# Altium schematic sheet STM32G4_microcontroller.SchDoc: STM32G4 microcontroller
size A4; Date: Not used; ApprovedBy: Not used; CheckedBy: Not used; Author: Not used; CompanyName: STMicroelectronics; DrawnBy: Not used; Engineer: Not used; Organization: Not used; Address1: Not used; Address2: Not used; Address3: Not used; Address4: Not used; DocumentNumber: Not used; Revision: Not used; SheetNumber: 3; SheetTotal: 7; CurrentTime: Not used; CurrentDate: Not used; Time: Not used; DocumentFullPathAndName: Not used; DocumentName: Not used; ModifiedDate: Not used; ImagePath: Not used; ProjectName: Not used; Application_BuildNumber: Not used
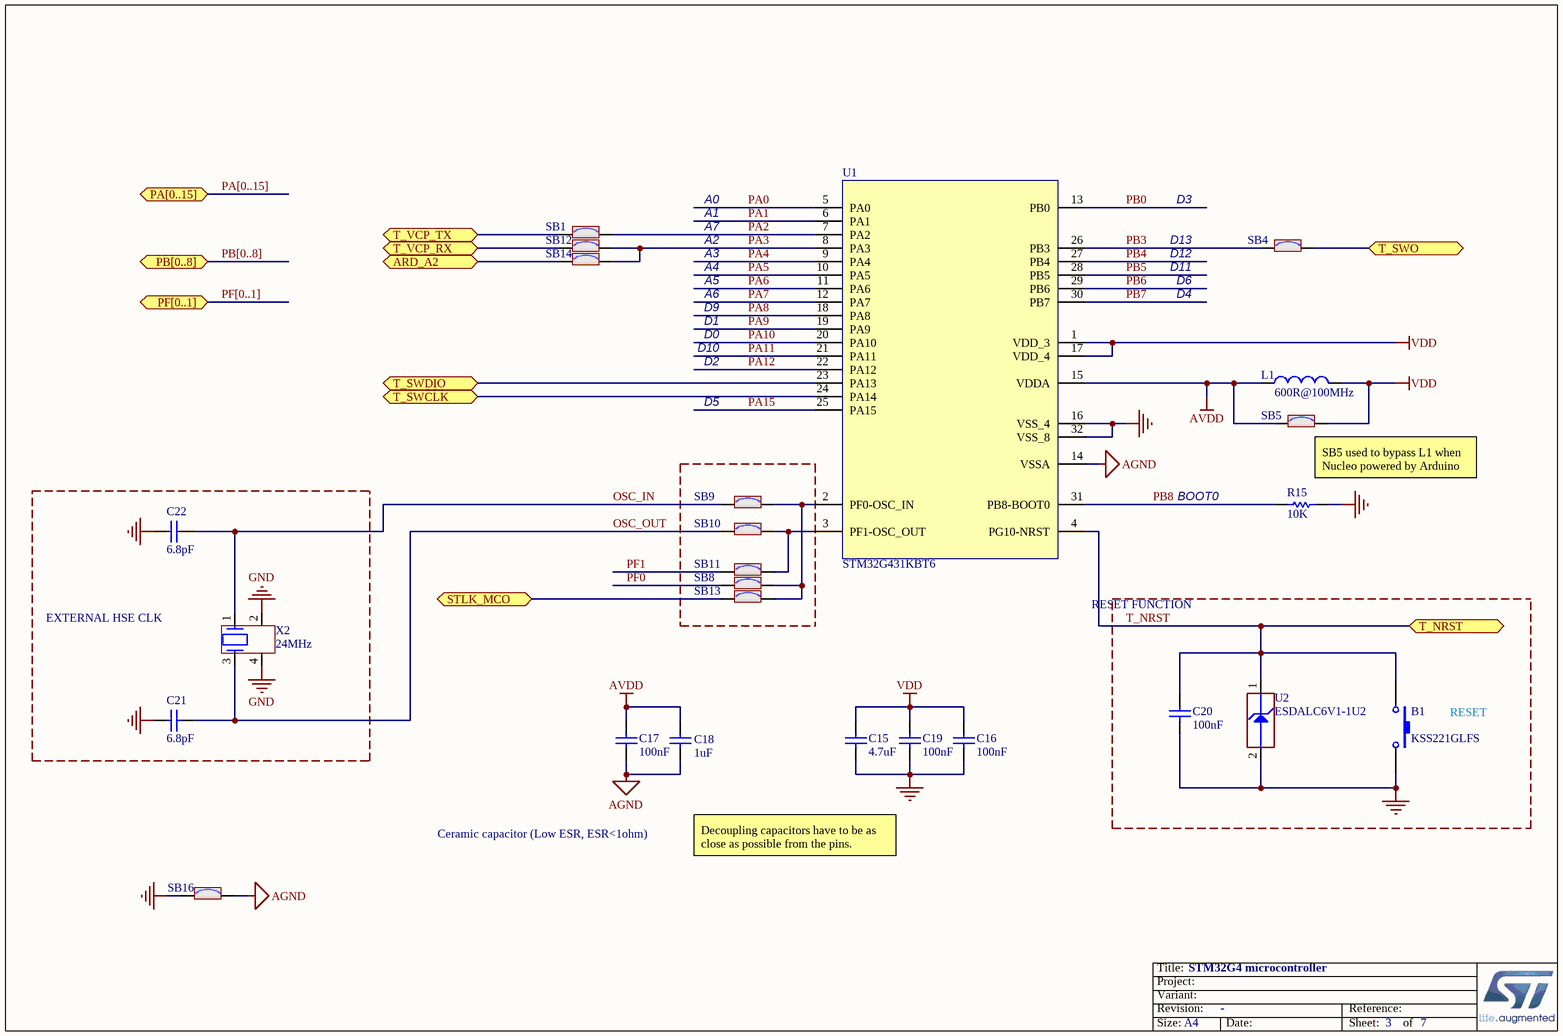
[diagram p0: STM32G4_microcontroller.SchDoc]

## Parts
B1  value KSS221GLFS  [SWI_C&K_ITT_KSS221G]
C15  value 4.7uF  [C0603]
C16  value 100nF  [C0402]
C17  value 100nF  [C0402]
C18  value 1uF  [C0603]
C19  value 100nF  [C0402]
C20  value 100nF  [C0402]
C21  value 6.8pF  [C0402]
C22  value 6.8pF  [C0402]
L1  value 600R@100MHz  [L0603]
R15  value 10K  [R0603]
SB1  (no value)  [SOLDER-BRIDGE_R0603-0R]
SB4  (no value)  [SOLDER-BRIDGE_R0603-0R]
SB5  (no value)  [SOLDER-BRIDGE_R0603-0R]
SB8  (no value)  [SOLDER-BRIDGE_R0603-0R]
SB9  (no value)  [SOLDER-BRIDGE_R0603-0R]
SB10  (no value)  [SOLDER-BRIDGE_R0603-0R]
SB11  (no value)  [SOLDER-BRIDGE_R0603-0R]
SB12  (no value)  [SOLDER-BRIDGE_R0603-0R]
SB13  (no value)  [SOLDER-BRIDGE_R0603-0R]
SB14  (no value)  [SOLDER-BRIDGE_R0603-0R]
SB16  (no value)  [SOLDER-BRIDGE_R0603-0R]
U1  value STM32G431KBT6  [ICC_LQFP32_7X7_P080__UFQFPN32-EPAD_5X5_P050__DI]
U2  value ESDALC6V1-1U2  [ESD_ST0201]
X2  value 24MHz  [CRY_NX2016SA_4P]

## Blocks framed on the sheet
EXTERNAL HSE CLK: C21 C22 X2

## Ports
ARD_A2, PA[0..15] (bidir), PB[0..8] (bidir), PF[0..1] (bidir), STLK_MCO, T_NRST, T_SWCLK, T_SWDIO, T_SWO, T_VCP_RX, T_VCP_TX

## Nets
AGND: C17.1 C18.1 SB16.2 U1.14(VSSA)
AVDD: C17.2 C18.2 L1.1 SB5.1 U1.15(VDDA)
GND: B1.2 C15.1 C16.1 C19.1 C20.1 C21.1 C22.1 R15.1 SB16.1 U1.16(VSS_4) U1.32(VSS_8) U2.2(GND) X2.2 X2.4
VDD: C15.2 C16.2 C19.2 L1.2 SB5.2 U1.1(VDD_3) U1.17(VDD_4)
ARD_A2: SB14.1 ; port ARD_A2
OSC_IN: C22.2 SB9.1 X2.1
OSC_OUT: C21.2 SB10.1 X2.3
PA0: U1.5(PA0)
PA1: U1.6(PA1)
PA2: SB1.2 U1.7(PA2)
PA3: SB12.2 SB14.2 U1.8(PA3)
PA4: U1.9(PA4)
PA5: U1.10(PA5)
PA6: U1.11(PA6)
PA7: U1.12(PA7)
PA8: U1.18(PA8)
PA9: U1.19(PA9)
PA10: U1.20(PA10)
PA11: U1.21(PA11)
PA12: U1.22(PA12)
PA15: U1.25(PA15)
PB0: U1.13(PB0)
PB3: SB4.1 U1.26(PB3)
PB4: U1.27(PB4)
PB5: U1.28(PB5)
PB6: U1.29(PB6)
PB7: U1.30(PB7)
PB8: R15.2 U1.31(PB8-BOOT0)
PF0: SB8.1
PF1: SB11.1
STLK_MCO: SB13.1 ; port STLK_MCO
T_NRST: B1.1 C20.2 U1.4(PG10-NRST) U2.1(IO1) ; port T_NRST
T_SWCLK: U1.24(PA14) ; port T_SWCLK
T_SWDIO: U1.23(PA13) ; port T_SWDIO
T_SWO: SB4.2 ; port T_SWO
T_VCP_RX: SB12.1 ; port T_VCP_RX
T_VCP_TX: SB1.1 ; port T_VCP_TX
NetSB8_2: SB8.2 SB9.2 SB13.2 U1.2(PF0-OSC_IN)
NetSB10_2: SB10.2 SB11.2 U1.3(PF1-OSC_OUT)

## Buses and harness runs
bus PA[0..15] = port PA[0..15]
bus PB[0..8] = port PB[0..8]
bus PF[0..1] = port PF[0..1]

## Notes on the sheet
- A0
- A1
- A2
- A7
- D13
- D3
- D9
- A3
- A4
- A5
- A6
- D12
- D11
- D4
- D6
- D1
- D0
- D10
- D2
- D5
- (near R15) BOOT0
- (near SB5) SB5 used to bypass L1 when Nucleo powered by Arduino AVDD.
- RESET FUNCTION
- RESET
- Ceramic capacitor (Low ESR, ESR<1ohm)
- Decoupling capacitors have to be as close as possible from the pins.
- Title:
- Project:
- Size:
- Revision:
- Variant:
- -
- Date:
- Reference:
- Sheet:
- of

## Library data of the parts
B1 = MCD-01335: Subminiature Side Actuated Tact Switch for SMT - KSS series - 2.0 Newtons - Gull wing, SPST; Part_Type: Misc; Manufacturer: C&K; Provided_By: SUBCO; Initial_Board_Reference: MB1430; Internal_Part_Number: MCD-01335; Status: Checked; Manufacturer_Part_Number: KSS221GLFS; ComponentLink1Description: Datasheet; ComponentLink1URL: http://tunmcdsvn.tun.st.com/Component_Datasheet_Library/Trunk/Misc/C&K_switch_button_KSS221GLFS/C&K_SWITCH_KSS221GLFS.pdf
C15 = MCD-00009: Capacitor, MLCC, 4.7uF, 16V, X5R, 10%, 0603, T=0.8mm; Manufacturer_Part_Number: CC0603KRX5R7BB475; Manufacturer: YAGEO; Provided_By: SUBCO; Initial_Board_Reference: MB1274; Internal_Part_Number: MCD-00009; ComponentLink1Description: Datasheet; Status: Released; Part_Type: Capacitor; Package: C0603; ComponentLink1URL: http://tunmcdsvn.tun.st.com/Component_Datasheet_Library/Trunk/Capacitors/Yageo_Multilayer_capacitor_X5R_series_100pF_to_100uF
C16 C17 C19 C20 = MCD-00102: Capacitor, MLCC, 100nF, 16V, X7R, 10%, 0402, T=0,5mm; Manufacturer_Part_Number: CC0402KRX7R7BB104; Manufacturer: YAGEO; Provided_By: SUBCO; Initial_Board_Reference: MB1262; Internal_Part_Number: MCD-00102; Status: Released; Package: C0402; ComponentLink1Description: Datasheet; Part_Type: Capacitor; ComponentLink1URL: http://tunmcdsvn.tun.st.com/Component_Datasheet_Library/Trunk/Capacitors/Yageo_Multilayer_Capacitor_X7R_series_100pF_to_22uF
C18 = MCD-00010: Capacitor, MLCC, 1uF, 16V, X5R, 10%, 0603, T=0,8mm; Manufacturer_Part_Number: CC0603KRX5R7BB105; Manufacturer: YAGEO; Provided_By: SUBCO; Initial_Board_Reference: MB1274; Internal_Part_Number: MCD-00010; Status: Released; Package: C0603; ComponentLink1Description: Datasheet; Part_Type: Capacitor; ComponentLink1URL: http://tunmcdsvn.tun.st.com/Component_Datasheet_Library/Trunk/Capacitors/Yageo_Multilayer_capacitor_X5R_series_100pF_to_100uF
C21 C22 = MCD-00674: Capacitor, MLCC, 6.8pF, 50V, NPO, +-0.25pF, 0402, T=0.5mm; Manufacturer_Part_Number: CC0402CRNPO9BN6R8; Manufacturer: YAGEO; Provided_By: SUBCO; Initial_Board_Reference: MB1319; Internal_Part_Number: MCD-00674; Status: Released; Part_Type: Capacitor; Package: C0402; ComponentLink1Description: Datasheet; ComponentLink1URL: http://tunmcdsvn.tun.st.com/Component_Datasheet_Library/Trunk/Capacitors/Yageo_Capacitor_NP0_16V-to-50V
L1 = MCD-00047: SMD Chip ferrite bead, 600R@100MHz +/-25%, 350mA, 500mohm DC, 0603, T=0.8mm; Part_Type: Inductor; Manufacturer_Part_Number: FCM1608KF-601T03; Manufacturer: TAI-TECH; Provided_By: SUBCO; Initial_Board_Reference: MB1274; Internal_Part_Number: MCD-00047; Status: Released; ComponentLink1Description: Datasheet; ComponentLink1URL: http://tunmcdsvn.tun.st.com/Component_Datasheet_Library/Trunk/Inductors/TaiTech_Bead_FCM1608_series
R15 = MCD-00220: Resistor,10K,0603,1%,1/10W; Manufacturer_Part_Number: RC0603FR-0710KL; Manufacturer: YAGEO; Provided_By: SUBCO; Initial_Board_Reference: MB1319; Internal_Part_Number: MCD-00220; ComponentLink1Description: Datasheet; Status: Released; Part_Type: Resistor; Package: R0603; ComponentLink1URL: http://tunmcdsvn.tun.st.com/Component_Datasheet_Library/Trunk/Resistors/Yageo_Resistor_RC0603-series
SB1 SB4 SB5 SB8-SB14 SB16 = MCD-00071: Solder Bridge ON; Part_Type: Mechanical; Manufacturer_Part_Number: RC0603JR-070RL; Manufacturer: YAGEO; Provided_By: SUBCO; Initial_Board_Reference: MB1274; Internal_Part_Number: MCD-00071; Status: Released; ComponentLink1Description: Datasheet; Package: SB0603; ComponentLink1URL: http://tunmcdsvn.tun.st.com/Component_Datasheet_Library/Trunk/Resistors/Yageo_Resistor_RC0603-series
U1 = MCD-01396: STM32G431, LQFP32 package, with double footprint (LQFP32_5V & UFQFPN32_A0B8); Part_Type: IC; Manufacturer: STMICROELECTRONICS; Provided_By: SUBCO with ST control; Initial_Board_Reference: MB1430; Internal_Part_Number: MCD-01396; Status: Checked; Manufacturer_Part_Number: STM32G431KBT6; Package: LQFP32-5V; ComponentLink1Description: Datasheet; ComponentLink1URL: http://tunmcdsvn.tun.st.com/Component_Datasheet_Library/Trunk/IC/STM_MCU_STM32G4xx
U2 = MCD-00170: ESD protection 6V1; Part_Type: Diode; Manufacturer: STMICROELECTRONICS; BMS_Part_Number: 9151132; Provided_By: SUBCO with ST control; Initial_Board_Reference: MB1274; Internal_Part_Number: MCD-00170; Status: Released; Manufacturer_Part_Number: ESDALC6V1-1U2; ComponentLink1Description: Datasheet; ComponentLink1URL: http://tunmcdsvn.tun.st.com/Component_Datasheet_Library/Trunk/Diodes/STM_ESD_ESDALC6V1-1U2
X2 = MCD-01036: 24MHz crystal oscillator - Cl:6pf -; Part_Type: Crystal_Osc; Manufacturer_Part_Number: NX2016SA 24MHz EXS00A-CS10820; Manufacturer: NDK; Provided_By: ST; Initial_Board_Reference: MB1332; Internal_Part_Number: MCD-01036; Status: Checked; Package: (2016) 2.0 x 1.6 x 0.45 mm; ComponentLink1Description: Datasheet; ComponentLink1URL: http://tunmcdsvn.tun.st.com/Component_Datasheet_Library/Trunk/Crystal_Osc/NDK_NX2016SA 24MHz EXS00A-CS10820 (EXS10B-27366B)